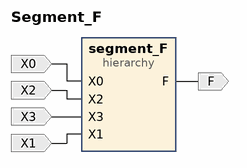
[diagram p0: block diagram of the top level]
# Vivado block design Segment_F, xc7a35tcpg236-1, Vivado 2018.3
create_bd_design Segment_F

create_bd_port -dir I X1
create_bd_port -dir O F
create_bd_port -dir I X0
create_bd_port -dir I X2
create_bd_port -dir I X3

create_bd_cell -type hier segment_F

# ---- hierarchy /segment_F ----
current_bd_instance /segment_F
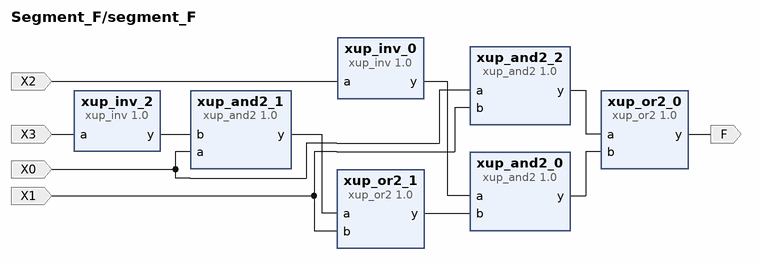
[diagram p1: block diagram inside /segment_F]
create_bd_pin -dir I X0
create_bd_pin -dir O F
create_bd_pin -dir I X1
create_bd_pin -dir I X3
create_bd_pin -dir I X2

create_bd_cell -type ip -vlnv xilinx.com:xup:xup_inv:1.0 xup_inv_0
set_property -dict {CONFIG.DELAY 0} [get_bd_cells xup_inv_0]
create_bd_cell -type ip -vlnv xilinx.com:xup:xup_inv:1.0 xup_inv_2
set_property -dict {CONFIG.DELAY 0} [get_bd_cells xup_inv_2]
create_bd_cell -type ip -vlnv xilinx.com:xup:xup_and2:1.0 xup_and2_0
set_property -dict {CONFIG.DELAY 0} [get_bd_cells xup_and2_0]
create_bd_cell -type ip -vlnv xilinx.com:xup:xup_or2:1.0 xup_or2_0
set_property -dict {CONFIG.DELAY 0} [get_bd_cells xup_or2_0]
create_bd_cell -type ip -vlnv xilinx.com:xup:xup_and2:1.0 xup_and2_1
set_property -dict {CONFIG.DELAY 0} [get_bd_cells xup_and2_1]
create_bd_cell -type ip -vlnv xilinx.com:xup:xup_and2:1.0 xup_and2_2
set_property -dict {CONFIG.DELAY 0} [get_bd_cells xup_and2_2]
create_bd_cell -type ip -vlnv xilinx.com:xup:xup_or2:1.0 xup_or2_1
set_property -dict {CONFIG.DELAY 0} [get_bd_cells xup_or2_1]

# ---- connections ----

current_bd_instance /segment_F
connect_bd_net [get_bd_pins xup_or2_0/y] [get_bd_pins F]
connect_bd_net [get_bd_pins xup_inv_0/y] [get_bd_pins xup_and2_0/a]
connect_bd_net -net X2_1 [get_bd_pins X2] [get_bd_pins xup_inv_0/a]
connect_bd_net [get_bd_pins xup_and2_0/y] [get_bd_pins xup_or2_0/b]
connect_bd_net [get_bd_pins xup_and2_2/y] [get_bd_pins xup_or2_0/a]
connect_bd_net -net X0_1 [get_bd_pins X0] [get_bd_pins xup_and2_2/a] [get_bd_pins xup_and2_1/a]
connect_bd_net -net X1_1 [get_bd_pins X1] [get_bd_pins xup_and2_2/b] [get_bd_pins xup_or2_1/b]
connect_bd_net [get_bd_pins xup_or2_1/y] [get_bd_pins xup_and2_0/b]
connect_bd_net [get_bd_pins xup_and2_1/y] [get_bd_pins xup_or2_1/a]
connect_bd_net -net X3_1 [get_bd_pins X3] [get_bd_pins xup_inv_2/a]
connect_bd_net [get_bd_pins xup_inv_2/y] [get_bd_pins xup_and2_1/b]

current_bd_instance /
connect_bd_net -net c_0_1 [get_bd_ports X0] [get_bd_pins segment_F/X0]
connect_bd_net -net a_0_1 [get_bd_ports X2] [get_bd_pins segment_F/X2]
connect_bd_net -net a_1_1 [get_bd_ports X3] [get_bd_pins segment_F/X3]
connect_bd_net -net xup_or3_0_y [get_bd_pins segment_F/F] [get_bd_ports F]
connect_bd_net -net X1_1 [get_bd_ports X1] [get_bd_pins segment_F/X1]

validate_bd_design
save_bd_design
